# EAGLE design trackboard (EAGLE 7.7.0)
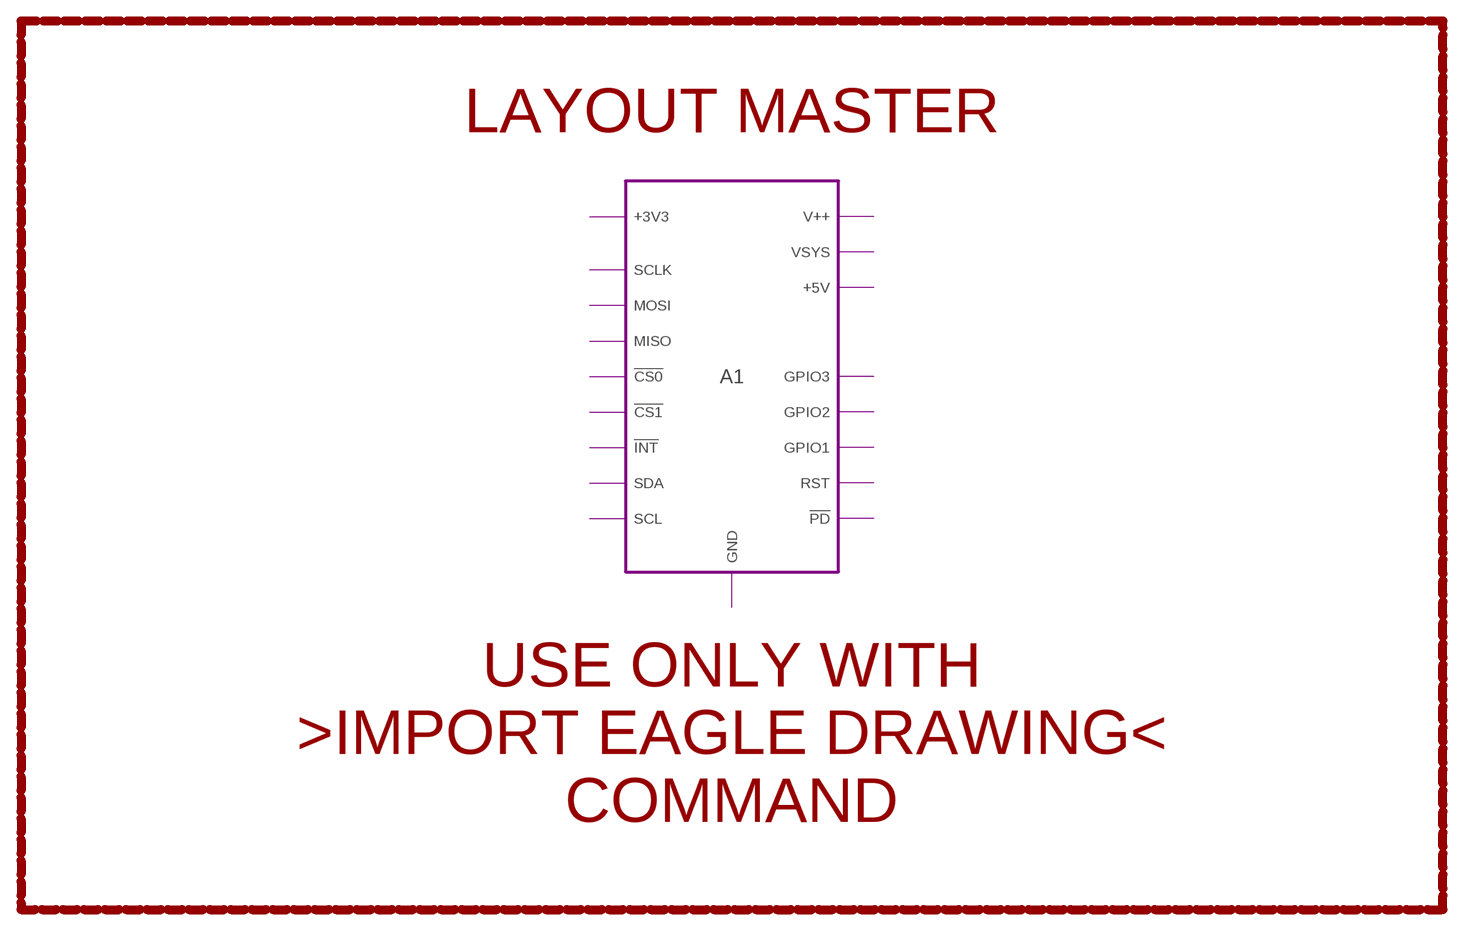
[diagram p0: schematic, sheet 1]

## Module instances
A1 = X1-TRACKBOARD3080

## Notes on the sheet
- LAYOUT MASTER
- USE ONLY WITH
  >IMPORT EAGLE DRAWING<
  COMMAND

## Library data of the parts

## Module X1-TRACKBOARD3080
Ports: !CS0(io) SCLK(io) MOSI(io) MISO(io) !CS1(io) !INT(io) SDA(io) SCL(io) GND(io) !PD(io) RST(io) GPIO1(io) GPIO2(io) GPIO3(io) +3V3(io) +5V(io) VSYS(io) V++(io)
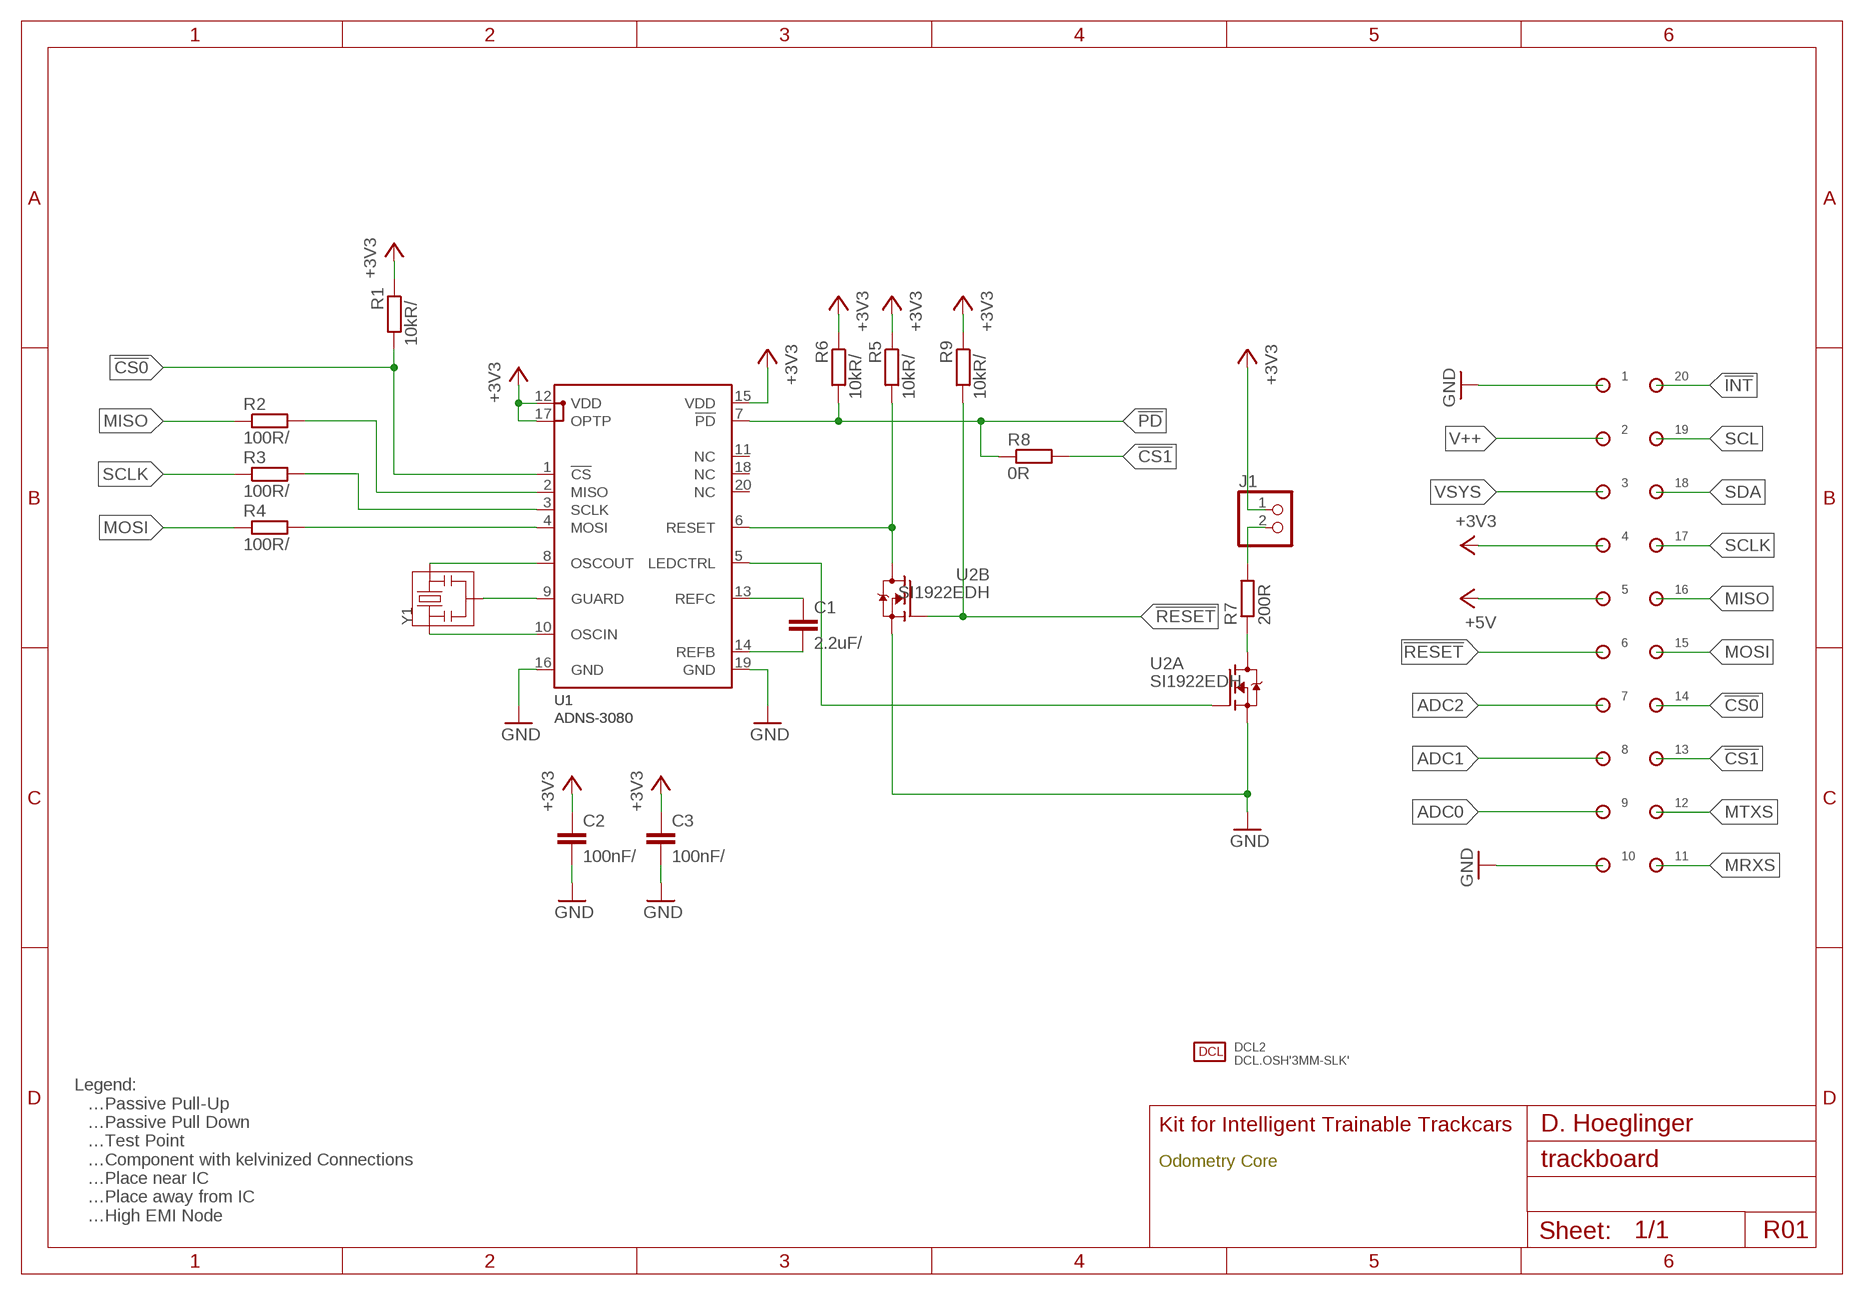
[diagram p1: schematic, module X1-TRACKBOARD3080, sheet 1]

### Parts
C1  2.2uF/⇤  C-EUC1608  [C1608]
C2  100nF/⇤  C-EUC0805K  [C0805K]
C3  100nF/⇤  C-EUC0805K  [C0805K]
DCL2  DCL.OSH'3MM-SLK'  [DCL.LOGO-OSH.3MM]
J1  PINHD-1X2  [1X02]
R1  10kR/⎒  R-EU_R0402  [R0402]
R2  100R/⇤  R-EU_R0402  [R0402]
R3  100R/⇤  R-EU_R0402  [R0402]
R4  100R/⇤  R-EU_R0402  [R0402]
R5  10kR/⎒  R-EU_R0402  [R0402]
R6  10kR/⎒  R-EU_R0402  [R0402]
R7  200R  R-EU_R0402  [R0402]
R8  0R  R-EU_R0402  [R0402]
R9  10kR/⎒  R-EU_R0402  [R0402]
U1  ADNS-3080  [ADNS-3080]
U2  SI1922EDH  [SC70-6]
Y1  24MHz  RESON  [RESON-SMD]
⌁1  SINGLEPAD40MIL  [PAD40MIL]
⌁2  SINGLEPAD40MIL  [PAD40MIL]
⌁3  SINGLEPAD40MIL  [PAD40MIL]
⌁4  SINGLEPAD40MIL  [PAD40MIL]
⌁5  SINGLEPAD40MIL  [PAD40MIL]
⌁6  SINGLEPAD40MIL  [PAD40MIL]
⌁7  SINGLEPAD40MIL  [PAD40MIL]
⌁8  SINGLEPAD40MIL  [PAD40MIL]
⌁9  SINGLEPAD40MIL  [PAD40MIL]
⌁10  SINGLEPAD40MIL  [PAD40MIL]
⌁11  SINGLEPAD40MIL  [PAD40MIL]
⌁12  SINGLEPAD40MIL  [PAD40MIL]
⌁13  SINGLEPAD40MIL  [PAD40MIL]
⌁14  SINGLEPAD40MIL  [PAD40MIL]
⌁15  SINGLEPAD40MIL  [PAD40MIL]
⌁16  SINGLEPAD40MIL  [PAD40MIL]
⌁17  SINGLEPAD40MIL  [PAD40MIL]
⌁18  SINGLEPAD40MIL  [PAD40MIL]
⌁19  SINGLEPAD40MIL  [PAD40MIL]
⌁20  SINGLEPAD40MIL  [PAD40MIL]

### Nets
!CS0: R1.2 U1.1(!CS) ⌁14.X
!CS1: R8.2 ⌁13.X
!INT: ⌁20.X
!PD: R6.2 R8.1 U1.7(!PD)
!RESET: R9.2 U2.5(B:G) ⌁6.X
+3V3: C2.1 C3.1 J1.1 R1.1 R5.1 R6.1 R9.1 U1.12(VDD) U1.15(VDD) U1.17(OPTP) ⌁4.X
+5V: ⌁5.X
ADC0: ⌁9.X
ADC1: ⌁8.X
ADC2: ⌁7.X
GND: C2.2 C3.2 U1.16(GND) U1.19(GND) U2.1(A:S) U2.4(B:S) ⌁1.X ⌁10.X
LEDCTRL: U1.5(LEDCTRL) U2.2(A:G)
MISO: R2.1 ⌁16.X
MOSI: R4.1 ⌁15.X
MRXS: ⌁11.X
MTXS: ⌁12.X
N$1: R7.1 U2.6(A:D)
N$5: C1.1 U1.13(REFC)
N$6: C1.2 U1.14(REFB)
N$8: J1.2 R7.2
RST: R5.2 U1.6(RESET) U2.3(B:D)
SCL: ⌁19.X
SCLK: R3.1 ⌁17.X
SDA: ⌁18.X
U1.GUARD: U1.9(GUARD) Y1.2
U1.MISO: R2.2 U1.2(MISO)
U1.MOSI: R4.2 U1.4(MOSI)
U1.OSCIN✳: U1.10(OSCIN) Y1.1
U1.OSCOUT✳: U1.8(OSCOUT) Y1.3
U1.SCLK: R3.2 U1.3(SCLK)
V++: ⌁2.X
VSYS: ⌁3.X
Unconnected: U1.11(NC) U1.18(NC) U1.20(NC)

### Notes on the sheet
- Legend:
  ⎒…Passive Pull-Up
  ⎑…Passive Pull Down
  ☇…Test Point
  ⚻…Component with kelvinized Connections
  ⇤…Place near IC
  ↦…Place away from IC
  ✳…High EMI Node
- Kit for Intelligent Trainable Trackcars | D. Hoeglinger
- Odometry Core
- R01

### Library data of the parts
C1-C3 = rcl:C-EU: CAPACITOR, European symbol
DCL2 = kitt.refs:DCL.OSH
J1 = pinhead:PINHD-1X2: PIN HEADER
R1-R9 = rcl:R-EU_: RESISTOR, European symbol
U1 = kitt.ic:ADNS-3080
U2 = kitt.ic:SI1922EDH
Y1 = Ai_Passives:RESON
⌁1-⌁20 = kitt.con:SINGLEPAD

## Board
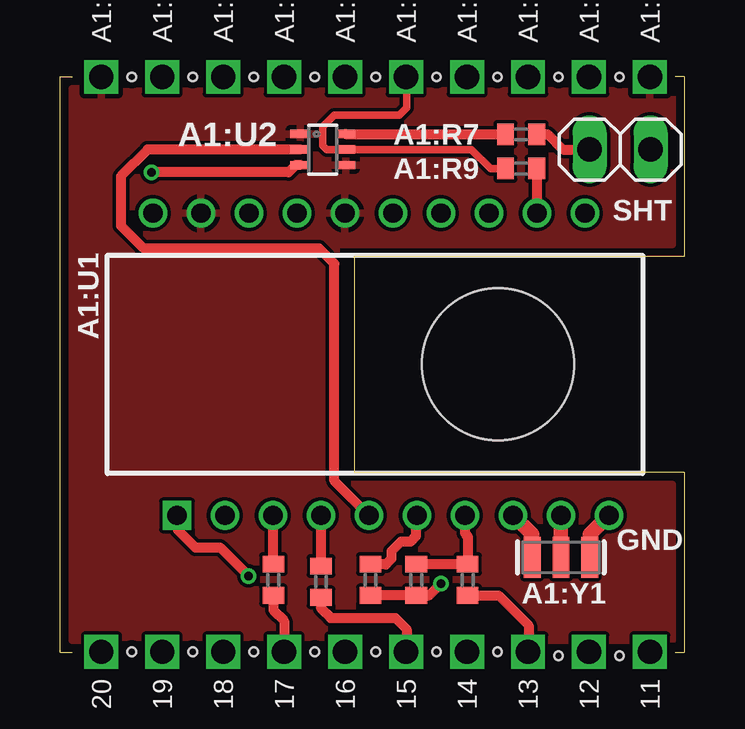
[diagram p2: board, top side]
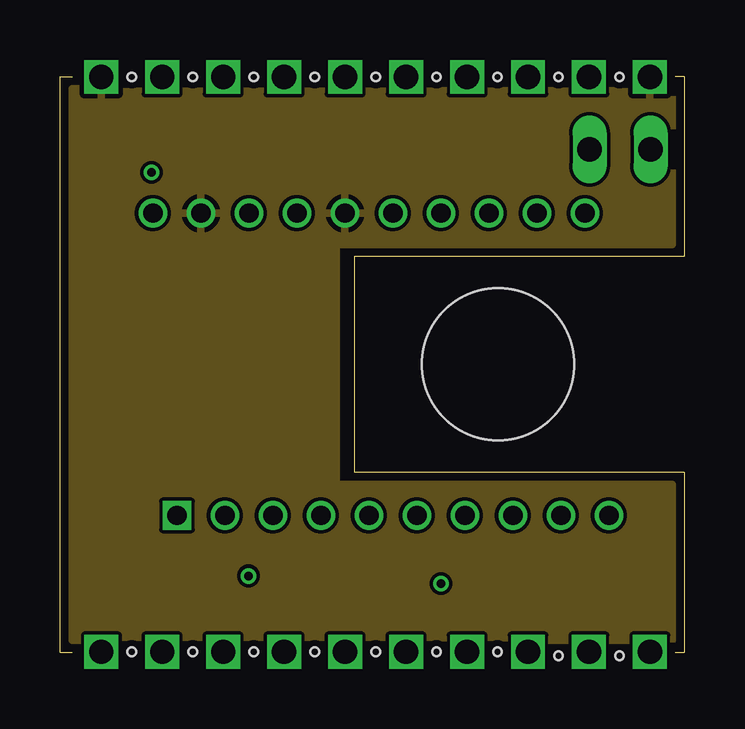
[diagram p3: board, inner layer Route2]
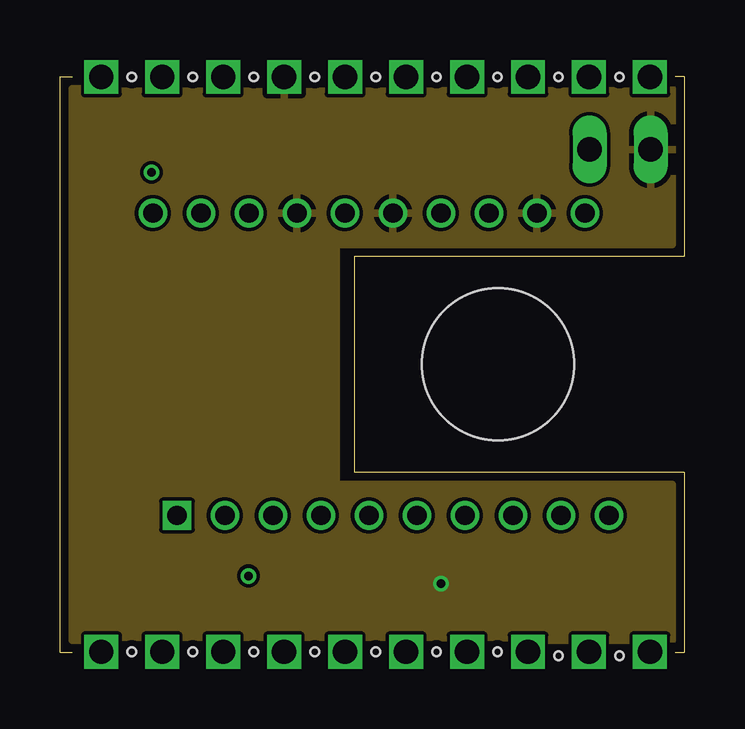
[diagram p4: board, inner layer Route15]
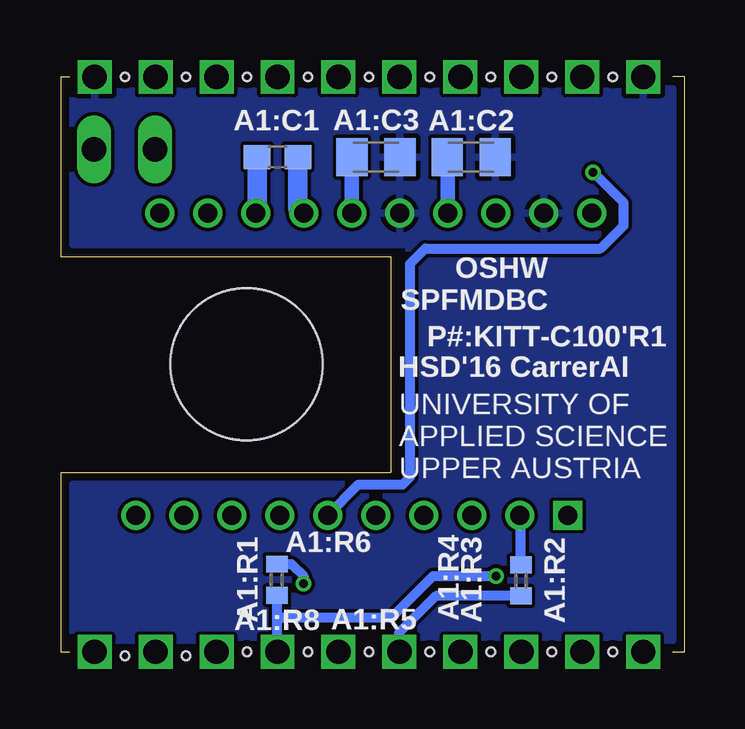
[diagram p5: board, bottom side, seen from below]

Size 26 x 24 mm. Coordinates in mm from the lower left corner, seen from the top.
Outline: 25.62,0 26,0 26,7.5 12.25,7.5 12.25,16.5 26,16.5 26,24 25.62,24
Outline: 0.5,0 0,0 0,24 0.5,24
Copper layers (1+2*15+16): Top 0.035mm / dielectric 0.38mm / Route2 0.035mm / dielectric 0.71mm / Route15 0.035mm / dielectric 0.38mm / Bottom 0.035mm
Design rules "PCB-POOL Standard_ML4": minimum track width 0.15mm, minimum drill 0.3mm, track to track 0.15mm, track to pad 0.15mm, pad to pad 0.15mm, via to via 0.15mm, smd to smd 0.15mm, copper to edge 0.3mm, drill to drill 0.2mm, minimum pad ring 0.2mm, minimum via ring 0.15mm, stop-mask expansion 0.075mm, vias tented up to drill 0mil, thermal gap 0.2mm
Holes 0.35 mm at 2.99,23.98 5.53,23.98 8.07,23.98 10.61,23.98 13.15,23.98 15.69,23.98 18.23,23.98 20.77,23.98 23.31,23.98 23.31,-0.15 20.77,-0.15 18.23,0.01 15.69,0.01 13.15,0.01 10.61,0.01 8.07,0.01 5.53,0.01 2.99,0.01

### Footprints (pad centres in the part's own frame; a part is rotated, then mirrored left to right if it is on the bottom)
C1608 = smd 1.1 x 1: 1 -0.85,0; 2 0.85,0
C0805K = smd 1.3 x 1.6: 1 -1,0; 2 1,0
1X02 = drill 1.016 long: 1 -1.27,0; 2 1.27,0
R0402 = smd 0.7 x 0.9: 1 -0.65,0; 2 0.65,0
ADNS-3080 = drill 0.8 square: 1 -8.126,-6.3 | drill 0.8: 2 -6.126,-6.3; 3 -4.126,-6.3; 4 -2.126,-6.3; 5 -0.126,-6.3; 6 1.874,-6.3; 7 3.874,-6.3; 8 5.874,-6.3; 9 7.874,-6.3; 10 9.874,-6.3; 11 8.874,6.3; 12 6.874,6.3; 13 4.874,6.3; 14 2.874,6.3; 15 0.874,6.3; 16 -1.126,6.3; 17 -3.126,6.3; 18 -5.126,6.3; 19 -7.126,6.3; 20 -9.126,6.3 | hole 6.35: 5.254,0
SC70-6 = smd 0.35 x 0.8: 1 -0.65,-0.95; 2 0,-0.95; 3 0.65,-0.95; 4 0.65,0.95; 5 0,0.95; 6 -0.65,0.95
RESON-SMD = smd 0.7 x 1.7: 1 -1.2,0; 2 0,0; 3 1.2,0
PAD40MIL = drill 1.016 square: X 0,0

### Placement (x,y rotation side)
A1:C1  2.2uF/⇤  [C1608]  16.96,20.65 0 bottom
A1:C2  100nF/⇤  [C0805K]  8.89,20.64 0 bottom
A1:C3  100nF/⇤  [C0805K]  12.86,20.64 0 bottom
A1:DCL2  DCL.OSH'3MM-SLK'  [DCL.LOGO-OSH.3MM]  2.38,15.08 0 bottom
A1:J1  [1X02]  23.34,20.95 180 top
A1:R1  10kR/⎒  [R0402]  16.99,3.02 270 bottom
A1:R2  100R/⇤  [R0402]  6.82,2.99 90 bottom
A1:R3  100R/⇤  [R0402]  8.89,3.02 90 top
A1:R4  100R/⇤  [R0402]  10.87,2.94 90 top
A1:R5  10kR/⎒  [R0402]  12.94,3.02 90 top
A1:R6  10kR/⎒  [R0402]  14.84,3.02 90 top
A1:R7  200R  [R0402]  19.21,21.59 0 top
A1:R8  0R  [R0402]  16.99,3.02 270 top
A1:R9  10kR/⎒  [R0402]  19.21,20.16 180 top
A1:U1  ADNS-3080  [ADNS-3080]  13,12 0 top
A1:U2  SI1922EDH  [SC70-6]  10.95,20.95 270 top
A1:Y1  24MHz  [RESON-SMD]  20.87,3.95 180 top
A1:⌁1  SINGLEPAD40MIL  [PAD40MIL]  1.72,23.98 270 top
A1:⌁2  SINGLEPAD40MIL  [PAD40MIL]  4.26,23.98 270 top
A1:⌁3  SINGLEPAD40MIL  [PAD40MIL]  6.8,23.98 270 top
A1:⌁4  SINGLEPAD40MIL  [PAD40MIL]  9.34,23.98 270 top
A1:⌁5  SINGLEPAD40MIL  [PAD40MIL]  11.88,23.98 270 top
A1:⌁6  SINGLEPAD40MIL  [PAD40MIL]  14.42,23.98 270 top
A1:⌁7  SINGLEPAD40MIL  [PAD40MIL]  16.96,23.98 270 top
A1:⌁8  SINGLEPAD40MIL  [PAD40MIL]  19.5,23.98 270 top
A1:⌁9  SINGLEPAD40MIL  [PAD40MIL]  22.04,23.98 270 top
A1:⌁10  SINGLEPAD40MIL  [PAD40MIL]  24.58,23.98 270 top
A1:⌁11  SINGLEPAD40MIL  [PAD40MIL]  24.58,0.01 90 top
A1:⌁12  SINGLEPAD40MIL  [PAD40MIL]  22.04,0.01 90 top
A1:⌁13  SINGLEPAD40MIL  [PAD40MIL]  19.5,0.01 90 top
A1:⌁14  SINGLEPAD40MIL  [PAD40MIL]  16.96,0.01 90 top
A1:⌁15  SINGLEPAD40MIL  [PAD40MIL]  14.42,0.01 90 top
A1:⌁16  SINGLEPAD40MIL  [PAD40MIL]  11.88,0.01 90 top
A1:⌁17  SINGLEPAD40MIL  [PAD40MIL]  9.34,0.01 90 top
A1:⌁18  SINGLEPAD40MIL  [PAD40MIL]  6.8,0.01 90 top
A1:⌁19  SINGLEPAD40MIL  [PAD40MIL]  4.26,0.01 90 top
A1:⌁20  SINGLEPAD40MIL  [PAD40MIL]  1.72,0.01 90 top

### Tracks (layer width: path | path; a pad name or v marks a point on that pad's centre or on a via)
A1:!CS0  (via drill 0.35)
  Top 0.406: A1:U1.1 4.92,5.65 4.92,5.08 5.64,4.37 6.67,4.37 v7.86,3.17
  Bottom 0.406: A1:⌁14.X 16.96,1.59 | 16.96,1.59 16.96,2.34 A1:R1.2 | 16.96,1.59 arc-90 16.8,1.43 12.22,1.43 10.48,3.17 v7.86,3.17
A1:!CS1
  Top 0.406: A1:R8.2 18.27,2.37 19.53,1.11 19.53,0.04 A1:⌁13.X
A1:!PD
  Top 0.406: 16.98,3.68 A1:R8.1 | A1:U1.7 16.87,4.96 16.99,4.84 A1:R8.1 | A1:R8.1 A1:R6.2
A1:!RESET
  Top 0.305: A1:R9.2 17.94,20.16 17.14,20.95 A1:U2.5 11.11,20.95 10.95,21.11 10.95,21.91 11.43,22.38 14.13,22.38 14.45,22.7 14.45,23.95 A1:⌁6.X
A1:+3V3  (via drill 0.35)
  Top 0.406: A1:R5.1 A1:R6.1 15.39,2.38 v15.88,2.86 | A1:R9.1 19.87,20.15 A1:U1.12
  Bottom 0.406: A1:R1.1 16.37,3.67 15.88,3.17 v15.88,2.86
  Bottom 0.61: A1:C3.1 13.87,20.63 A1:U1.15 | A1:C2.1 9.87,20.64 A1:U1.17
  pour Route15: 0.5,23.5 0.5,0.5 25.5,0.5 25.5,7 11.5,7 11.5,17 25.5,17 25.5,23.5
A1:GND
  pour Route2: 0.5,23.5 0.5,0.5 25.5,0.5 25.5,7 11.5,7 11.5,17 25.5,17 25.5,23.5
  pour Top: 0.5,23.5 0.5,0.5 25.5,0.5 25.5,7 11.5,7 11.5,17 25.5,17 25.5,23.5
  pour Bottom: 0.5,23.5 0.5,0.5 25.5,0.5 25.5,7 11.5,7 11.5,17 25.5,17 25.5,23.5
A1:LEDCTRL
  Top 0.406: A1:U1.5 11.43,7.14 11.43,16.19 10.79,16.83 3.49,16.83 2.54,17.78 2.54,19.84 3.65,20.95 A1:U2.2
A1:MISO
  Bottom 0.406: A1:R2.1 10.36,2.34 11.91,0.79 11.91,0.04 A1:⌁16.X
A1:MOSI
  Top 0.406: A1:R4.1 10.87,1.83 11.27,1.43 13.97,1.43 14.45,0.95 14.45,0.04 A1:⌁15.X
A1:N$1
  Top 0.406: A1:U2.6 18.43,21.61 18.57,21.59 A1:R7.1
A1:N$5
  Bottom 0.813: A1:C1.1 17.81,18.36 arc90 A1:U1.13
A1:N$6
  Bottom 0.813: A1:C1.2 16.11,18.54 arc-90 A1:U1.14
A1:N$8
  Top 0.406: A1:R7.2 20.32,21.59 20.95,20.95 A1:J1.2
A1:RST  (via drill 0.35)
  Top 0.406: A1:U2.3 9.83,20.3 9.53,20 v3.81,20 | A1:U1.6 14.87,5.56 14.83,5.56 14.83,4.83 14.61,4.6 14.21,4.6 13.81,4.21 13.81,3.89 13.57,3.65 12.95,3.65 A1:R5.2
  Bottom 0.406: A1:U1.6 13.59,6.99 11.75,6.99 11.43,7.3 11.43,16.19 10.79,16.83 3.49,16.83 2.54,17.78 2.54,18.73 v3.81,20
A1:SCLK
  Top 0.406: A1:R3.1 8.89,1.75 9.34,1.3 A1:⌁17.X
A1:U1.GUARD
  Top 0.61: A1:Y1.2 A1:U1.9
A1:U1.MISO
  Bottom 0.406: A1:R2.2 6.82,5.64 A1:U1.2
A1:U1.MOSI
  Top 0.406: A1:U1.4 10.87,3.67 arc90 A1:R4.2
A1:U1.OSCIN✳
  Top 0.61: A1:Y1.1 22.07,4.9 A1:U1.10
A1:U1.OSCOUT✳
  Top 0.61: A1:Y1.3 19.67,4.9 A1:U1.8
A1:U1.SCLK
  Top 0.406: A1:R3.2 8.89,5.68 A1:U1.3

### Text on the board
tNames: SHT | GND
bNames: P#:KITT-C100'R1 | OSHW / SPFMDBC | UNIVERSITY OF / APPLIED SCIENCE / UPPER AUSTRIA | HSD'16 CarrerAI